# Altium schematic sheet Main.SchDoc
size A3; PageSetup: Record=PageOptions|CenterHorizontal=True|CenterVertical=True|PrintScale=0.73|XCorrection=1.00|YCorrection=1.00|PrintKind=1|BorderSize=5000000|LeftOffset=0|BottomOffset=0|Orientation=2|PaperLength=1000|PaperWidth=1000|Scale=100|PaperSource=7|PrintQuality=-3|MediaType=1|DitherType=10|PrintScaleMode=1|PaperKind=A4|PaperIndex=9
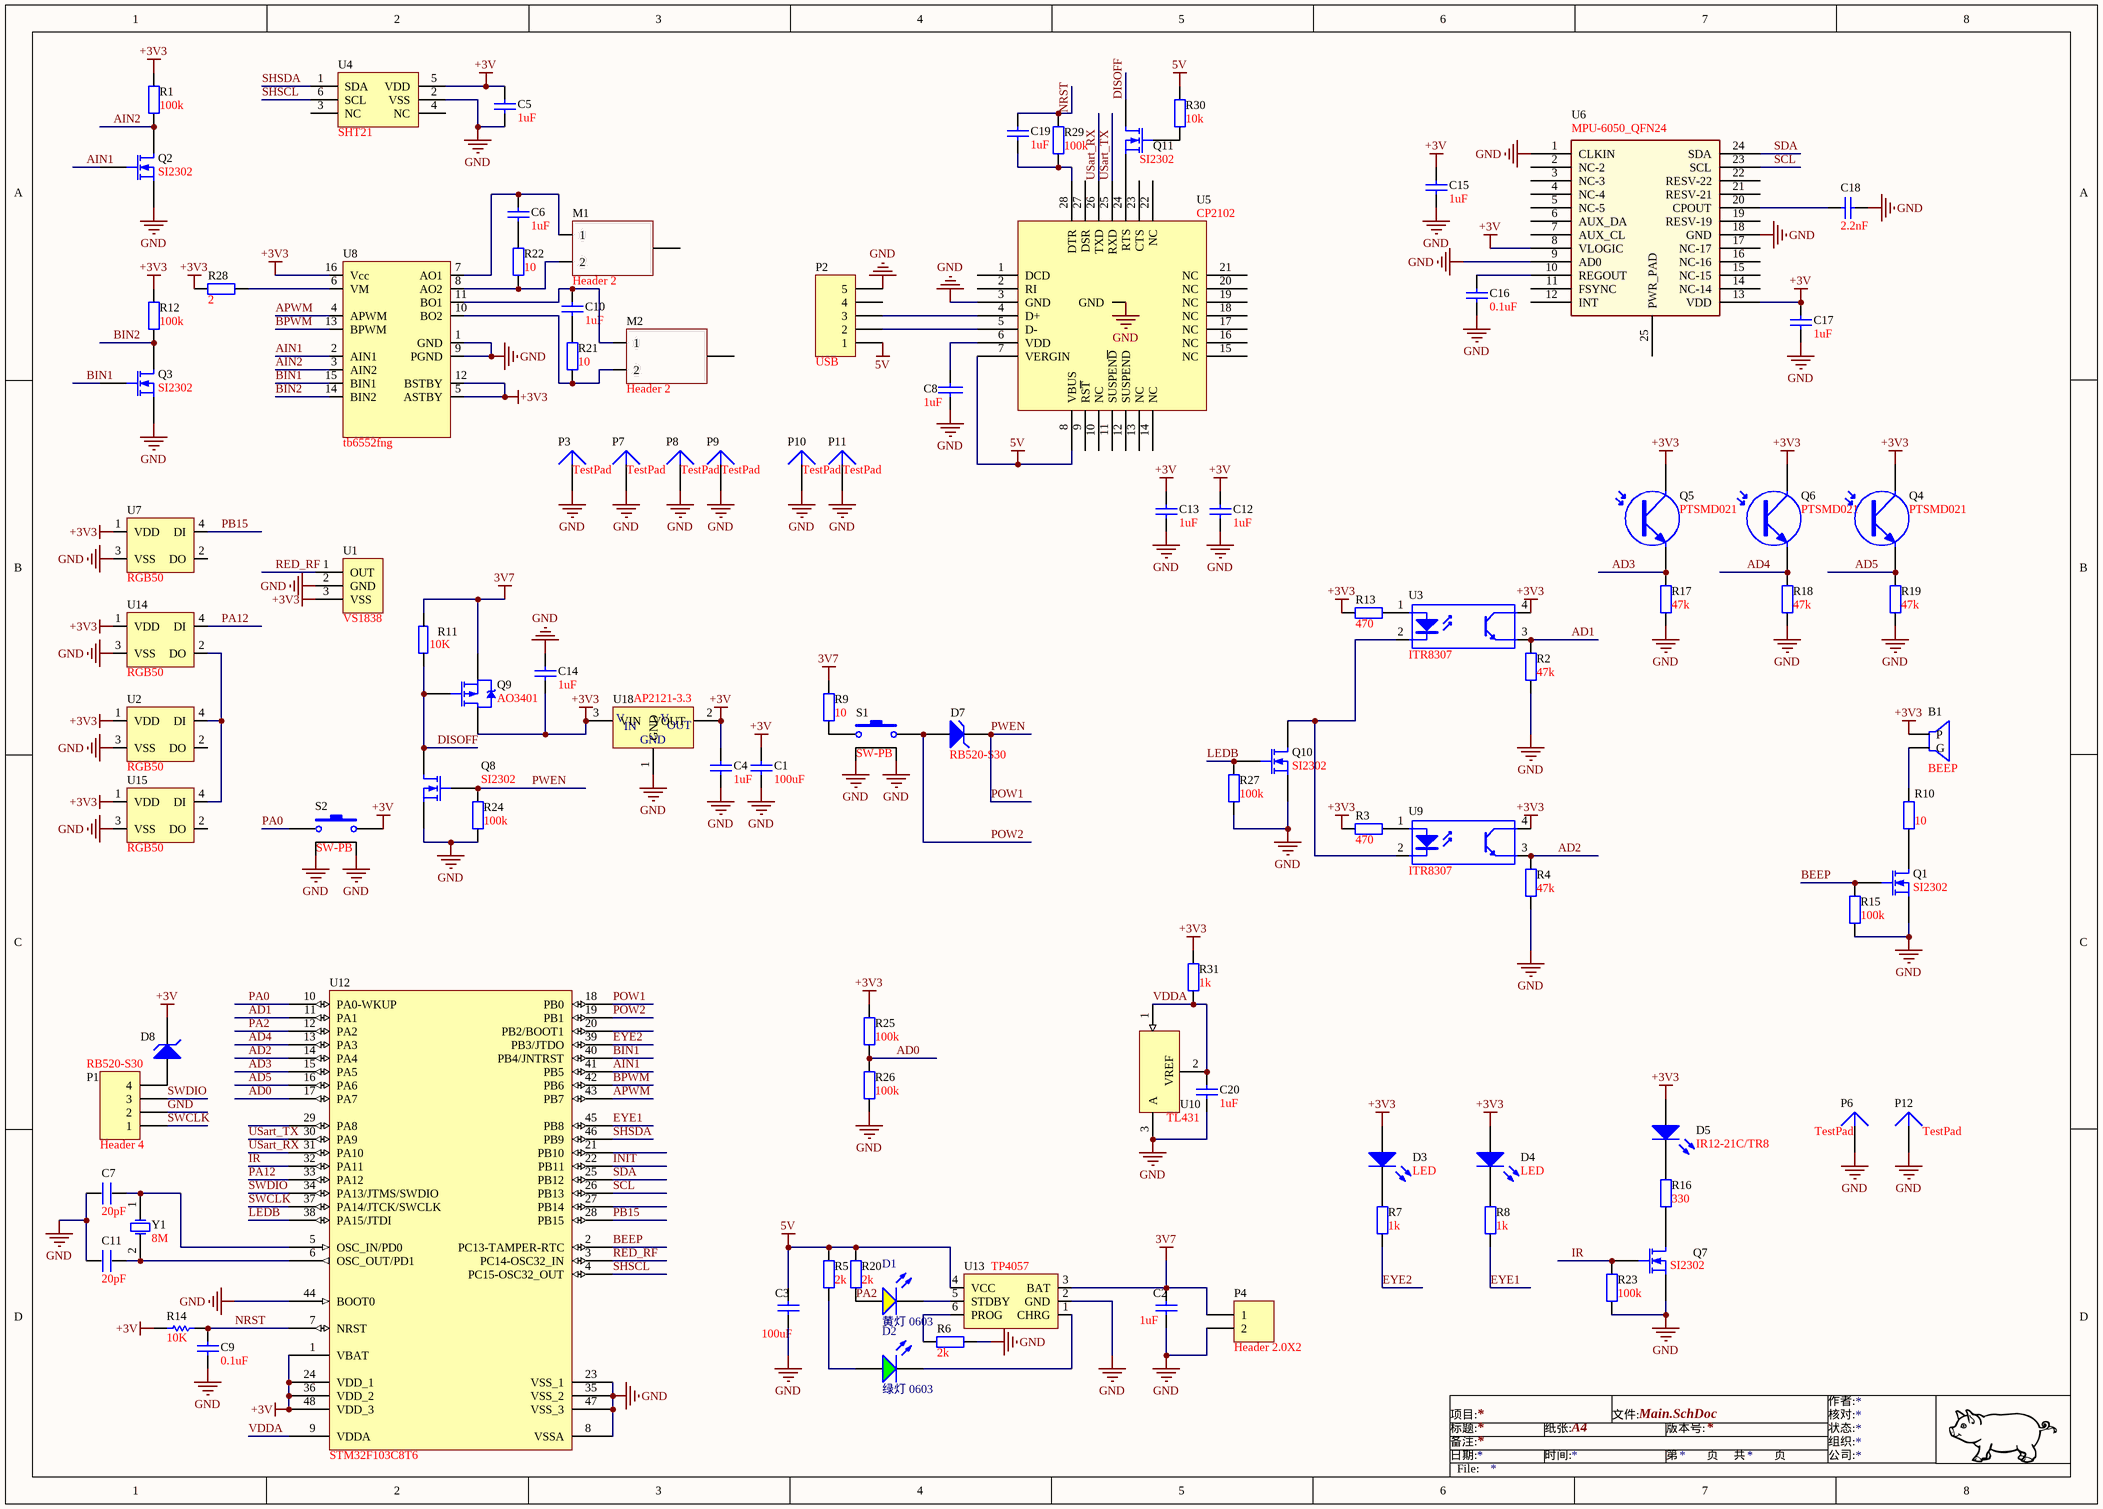
[diagram p0: Main.SchDoc]

## Parts
B1  BEEP  [BEEP]
C1  100uF  [3.5X2.8X1.9]
C2  1uF  [C0603]
C3  100uF  [3.5X2.8X1.9]
C4  1uF  [C0603]
C5  1uF  [c0603]
C6  1uF  [c0603]
C7  20pF  [C0603]
C8  1uF  [C0603]
C9  0.1uF  [C0603]
C10  1uF  [c0603]
C11  20pF  [C0603]
C12  1uF  [C0603]
C13  1uF  [C0603]
C14  1uF  [C0603]
C15  1uF  [C0603]
C16  0.1uF  [C0603]
C17  1uF  [C0603]
C18  2.2nF  [C0603]
C19  1uF  [c0603]
C20  1uF  [C0603]
D1  黄灯 0603  [0603_LED_S1]
D2  绿灯 0603  [0603_LED_S1]
D3  LED  [0802]
D4  LED  [0802]
D5  IR12-21C/TR8  [1206]
D7  RB520-S30  [LED]
D8  RB520-S30  [LED]
M1  Header 2  [PAD2]
M2  Header 2  [PAD2]
P1  Header 4  [SIP1.25-4]
P2  USB  [MICROUSB4]
P3  TestPad  [MOTO]
P4  Header 2.0X2  [Head2.0]
P6  TestPad  [PAD]
P7  TestPad  [MOTO]
P8  TestPad  [PAD]
P9  TestPad  [PAD]
P10  TestPad  [PAD]
P11  TestPad  [PAD]
P12  TestPad  [PAD]
Q1  SI2302  [SOT-23_L]
Q2  SI2302  [SOT-23_L]
Q3  SI2302  [SOT-23_L]
Q4  PTSMD021  [EYE]
Q5  PTSMD021  [EYE]
Q6  PTSMD021  [EYE]
Q7  SI2302  [SOT-23_L]
Q8  SI2302  [SOT-23_L]
Q9  AO3401  [SOT23_L]
Q10  SI2302  [SOT-23_L]
Q11  SI2302  [SOT-23_L]
R1  100k  [R0603]
R2  47k  [R0603]
R3  470  [R0603]
R4  47k  [R0603]
R5  2k  [R0603]
R6  2k  [R0603]
R7  1k  [R0603]
R8  1k  [R0603]
R9  10  [R0603]
R10  10  [R0603]
R11  10K  [R0603]
R12  100k  [R0603]
R13  470  [R0603]
R14  10K  [R0603]
R15  100k  [R0603]
R16  330  [R0603]
R17  47k  [R0603]
R18  47k  [R0603]
R19  47k  [R0603]
R20  2k  [R0603]
R21  10  [R0603]
R22  10  [R0603]
R23  100k  [R0603]
R24  100k  [R0603]
R25  100k  [R0603]
R26  100k  [R0603]
R27  100k  [R0603]
R28  2  [R0603]
R29  100k  [R0603]
R30  10k  [R0603]
R31  1k  [R0603]
S1  SW-PB  [BUTTON]
S2  SW-PB  [BUTTON]
U1  VS1838  [IR38]
U2  RGB50  [HV-EYE - duplicate]
U3  ITR8307  [ITR8307]
U4  SHT21  [SHT20]
U5  CP2102  [qfn-28]
U6  MPU-6050_QFN24  [qfn24]
U7  RGB50  [WS2812]
U8  tb6552fng  [SSOP16_L]
U9  ITR8307  [ITR8307]
U10  TL431  [SOT-23_L]
U12  STM32F103C8T6  [LQFP48_N]
U13  TP4057  [SOT23-6_N]
U14  RGB50  [WS2812]
U15  RGB50  [HV-EYE - duplicate]
U18  AP2121-3.3  [SOT-23]
Y1  8M  [16mhz]

## Nets
3V7: C2.2 P4.1 Q9.3(S) R9.2 R11.2 U13.3(BAT)
5V: C3.2 P2.1 R5.2 R20.2 R30.2 U5.7(VERGIN) U5.8(VBUS) U13.4(VCC)
+3V: C1.2 C4.1 C5.1 C12.1 C13.1 C15.1 C17.1 D8.2(K) R14.2 S2.1 U4.5(VDD) U6.8(VLOGIC) U6.13(VDD) U12.1(VBAT) U12.24(VDD_1) U12.36(VDD_2) U12.48(VDD_3) U18.2(VOUT)
+3V3: B1.1(P) C14.2 D3.1(A) D4.1(A) D5.1(A) Q4.1(C) Q5.1(C) Q6.1(C) Q9.2(D) R1.2 R3.1 R12.2 R13.1 R25.2 R28.2 R31.2 U1.3(VSS) U2.1(VDD) U3.4(C) U7.1(VDD) U8.5(ASTBY) U8.12(BSTBY) U8.16(Vcc) U9.4(C) U14.1(VDD) U15.1(VDD) U18.3(VIN)
GND: C1.1 C2.1 C3.1 C4.2 C5.2 C7.1 C8.1 C9.1 C11.1 C12.2 C13.2 C14.1 C15.2 C16.2 C17.2 C18.2 C20.2 P1.2 P2.5 P3.1 P4.2 P6.1 P7.1 P8.1 P9.1 P10.1 P11.1 P12.1 Q1.3(S) Q2.3(S) Q3.3(S) Q7.3(S) Q8.3(S) Q10.3(S) R2.1 R4.1 R6.1 R15.1 R17.2 R18.2 R19.2 R23.1 R24.1 R26.1 R27.1 S1.3 S1.4 S2.3 S2.4 U1.2(GND) U2.3(VSS) U4.2(VSS) U5.0(GND) U5.3(GND) U6.1(CLKIN) U6.9(AD0) U6.18(GND) U7.3(VSS) U8.1(GND) U8.9(PGND) U10.3(A) U12.8(VSSA) U12.23(VSS_1) U12.35(VSS_2) U12.44(BOOT0) U12.47(VSS_3) U13.2(GND) U14.3(VSS) U15.3(VSS) U18.1(GND)
AD0: R25.1 R26.2 U12.17(PA7)
AD1: R2.2 U3.3(E) U12.11(PA1)
AD2: R4.2 U9.3(E) U12.14(PA4)
AD3: Q5.2(E) R17.1 U12.15(PA5)
AD4: Q6.2(E) R18.1 U12.13(PA3)
AD5: Q4.2(E) R19.1 U12.16(PA6)
AIN1: Q2.2(G) U8.2(AIN1) U12.41(PB5)
AIN2: Q2.1(D) R1.1 U8.3(AIN2)
APWM: U8.4(APWM) U12.43(PB7)
BEEP: Q1.2(G) R15.2 U12.2(PC13-TAMPER-RTC)
BIN1: Q3.2(G) U8.15(BIN1) U12.40(PB4/JNTRST)
BIN2: Q3.1(D) R12.1 U8.14(BIN2)
BPWM: U8.13(BPWM) U12.42(PB6)
DISOFF: Q8.1(D) Q9.1(G) Q11.1(D) R11.1
EYE1: R8.1 U12.45(PB8)
EYE2: R7.1 U12.39(PB3/JTDO)
INIT: U12.22(PB11)
IR: Q7.2(G) R23.2 U12.32(PA11)
LEDB: Q10.2(G) R27.2 U12.38(PA15/JTDI)
NRST: C9.2 C19.1 R14.1 R29.2 U12.7(NRST)
PA0: S2.2 U12.10(PA0-WKUP)
PA2: D1.A R20.1 U12.12(PA2)
PA12: U12.33(PA12) U14.4(DI)
PB15: U7.4(DI) U12.28(PB15)
POW1: D7.2(K) Q8.2(G) R24.2 U12.18(PB0)  [also labelled PWEN]
POW2: D7.1(A) S1.2 U12.19(PB1)
RED_RF: U1.1(OUT) U12.3(PC14-OSC32_IN)
SCL: U6.23(SCL) U12.26(PB13)
SDA: U6.24(SDA) U12.25(PB12)
SHSCL: U4.6(SCL) U12.4(PC15-OSC32_OUT)
SHSDA: U4.1(SDA) U12.46(PB9)
SWCLK: P1.1 U12.37(PA14/JTCK/SWCLK)
SWDIO: P1.3 U12.34(PA13/JTMS/SWDIO)
USart_RX: U5.26(TXD) U12.31(PA10)
USart_TX: U5.25(RXD) U12.30(PA9)
VDDA: C20.1 R31.1 U10.1(K) U10.2 U12.9(VDDA)
NetB1_2: B1.2(G) R10.2
NetC6_1: C6.1 M1.1 U8.7(AO1)
NetC6_2: C6.2 R22.2
NetC7_2: C7.2 U12.5(OSC_IN/PD0) Y1.1(OSC1)
NetC8_2: C8.2 U5.6(VDD)
NetC10_1: C10.1 M2.1 U8.11(BO1)
NetC10_2: C10.2 R21.2
NetC11_2: C11.2 U12.6(OSC_OUT/PD1) Y1.2(OSC2)
NetC16_1: C16.1 U6.10(REGOUT)
NetC18_1: C18.1 U6.20(CPOUT)
NetC19_2: C19.2 R29.1 U5.28(DTR)
NetD1_K: D1.K U13.5(STDBY)
NetD2_A: D2.A R5.1
NetD2_K: D2.K U13.1(CHRG)
NetD3_2: D3.2(K) R7.2
NetD4_2: D4.2(K) R8.2
NetD5_2: D5.2(K) R16.2
NetD8_1: D8.1(A) P1.4
NetM1_2: M1.2 R22.1 U8.8(AO2)
NetM2_2: M2.2 R21.1 U8.10(BO2)
NetP2_2: P2.2 U5.5(D-)
NetP2_3: P2.3 U5.4(D+)
NetQ1_1: Q1.1(D) R10.1
NetQ7_1: Q7.1(D) R16.1
NetQ10_1: Q10.1(D) U3.2(K) U9.2(K)
NetQ11_2: Q11.2(G) R30.1
NetQ11_3: Q11.3(S) U5.24(RTS)
NetR3_2: R3.2 U9.1(A)
NetR6_2: R6.2 U13.6(PROG)
NetR9_1: R9.1 S1.1
NetR13_2: R13.2 U3.1(A)
NetR28_1: R28.1 U8.6(VM)
NetU2_4: U2.4(DI) U14.2(DO) U15.4(DI)

Not connected (* = marked no-connect by the designer): P2 4; U2 2(DO); U4 3(NC) 4(NC); U5 1(DCD) 2(RI) 9(RS~{T}) 10(NC) 11(SUSPEN~{D}) 12(SUSPEND) 13(NC) 14(NC) 15(NC) 16(NC) 17(NC) 18(NC) 19(NC) 20(NC) 21(NC) 22(NC) 23(CTS) 27(DSR); U6 2(NC-2) 3(NC-3) 4(NC-4) 5(NC-5) 6(AUX_DA) 7(AUX_CL) 11(FSYNC) 12(INT) 14(NC-14) 15(NC-15) 16(NC-16) 17(NC-17) 19(RESV-19) 21(RESV-21) 22(RESV-22) 25(PWR_PAD); U7 2(DO); U12 20(PB2/BOOT1) 21(PB10) 27(PB14) 29(PA8); U15 2(DO)

## Notes on the sheet
- 项目:
- 标题:
- 日期:
- 备注:
- 时间:
- 纸张:
- A4
- 文件:
- 版本号:
- 第
- 页
- 共
- 作者:
- 核对:
- 状态:
- 组织:
- 公司:
- File:
- (in symbol AP2121-3) V; IN; OUT
- (in symbol TL431AILP) VREF

## Library data of the parts
B1 = BEEP: 最小蜂鸣器6MM 6038 6035电磁式蜂鸣器 6*3.5 6*3.8MM 无源 交流
C1 C3 C16 C18 = Cap: 贴片电容; Value: 1uF; Published: 8-Jun-2000; LatestRevisionDate: 17-Jul-2002; LatestRevisionNote: Re-released for DXP Platform.; PackageReference: RAD-0.3; Publisher: Altium Limited; PackageDescription: Radial Cap, Thru-Hole; 2 Leads; 0.3 in Pin Spacing
C2 = Cap: 贴片电容; Value: 105; Published: 8-Jun-2000; LatestRevisionDate: 17-Jul-2002; LatestRevisionNote: Re-released for DXP Platform.; PackageReference: RAD-0.3; Publisher: Altium Limited; PackageDescription: Radial Cap, Thru-Hole; 2 Leads; 0.3 in Pin Spacing
C4-C6 C10 C12-C15 C17 C19 C20 = Cap: 贴片电容; Published: 8-Jun-2000; LatestRevisionDate: 17-Jul-2002; LatestRevisionNote: Re-released for DXP Platform.; PackageReference: RAD-0.3; Publisher: Altium Limited; PackageDescription: Radial Cap, Thru-Hole; 2 Leads; 0.3 in Pin Spacing; Value: 1uF
C7 C11 = C: 叠层贴片电容
C8 = CAP: 贴片电容
C9 = CAP: 电容; Value: 100pF; Published: 8-Jun-2000; Revision: July-2002: Re-released for DXP Platform.; Publisher: Altium Limited
D1 = 0603 黄灯: 发光二极管; ComponentLink1Description: 供应商链接; ComponentLink1URL: http://www.szlcsc.com/product/details_73147.html; Package: 0603; Supplier: LC; SuppliersPartNumber: C72038
D2 = 0603 绿灯: 发光二极管; ComponentLink1Description: 供应商链接; ComponentLink1URL: http://www.szlcsc.com/product/details_73152.html; Package: 0603; Supplier: LC; SuppliersPartNumber: C72043
D3 D4 = LED2: Typical RED, GREEN, YELLOW, AMBER GaAs LED; pin to pad: 1>2 2>1; Published: 8-Jun-2000; LatestRevisionDate: 17-Jul-2002; LatestRevisionNote: Re-released for DXP Platform.; PackageVersion: Feb-2002; PackageReference: 3.2X1.6X1.1; Publisher: Altium Limited; PackageDescription: SM LED; 2 Flat Leads
D5 = LED2: 侧贴红外发射管; Published: 8-Jun-2000; LatestRevisionDate: 17-Jul-2002; LatestRevisionNote: Re-released for DXP Platform.; PackageVersion: Feb-2002; PackageReference: 3.2X1.6X1.1; Publisher: Altium Limited; PackageDescription: SM LED; 2 Flat Leads
D7 D8 = D Zener: 肖基特二极管; Published: 8-Jun-2000; LatestRevisionDate: 17-Jul-2002; LatestRevisionNote: Re-released for DXP Platform.; PackageReference: DIODE-0.7; Publisher: Altium Limited; PackageDescription: Diode, Thru-Hole; 2 Leads; 0.7 in Pin Spacing
M1 M2 = Header 2: Header, 2-Pin; LatestRevisionDate: 17-Jul-2002; LatestRevisionNote: Re-released for DXP Platform.; Publisher: Altium Limited
P1 = Header 4: Header, 4-Pin; LatestRevisionDate: 17-Jul-2002; LatestRevisionNote: Re-released for DXP Platform.; Publisher: Altium Limited
P2 = Header 5: 迈克USB 接口 4个固定脚插板固定母座-5p贴片长针 MICRO usb接口 [交易快照]; LatestRevisionDate: 17-Jul-2002; LatestRevisionNote: Re-released for DXP Platform.; Publisher: Altium Limited
P3 P6-P12 = Plug: LatestRevisionDate: 17-Jul-2002; LatestRevisionNote: Re-released for DXP Platform.; Publisher: Altium Limited
P4 = Header 2: 2.0dip连接器; LatestRevisionDate: 17-Jul-2002; LatestRevisionNote: Re-released for DXP Platform.; Publisher: Altium Limited
Q1-Q3 Q7 Q8 Q10 Q11 = MOSFET-N: N-Channel MOSFET; pin to pad: 1>3 2>1 3>2; Published: 8-Jun-2000; LatestRevisionDate: 17-Jul-2002; LatestRevisionNote: Re-released for DXP Platform.; PackageVersion: 1995/1996; PackageReference: E3; Publisher: Altium Limited; PackageDescription: TO, Flat Index; 3 In-Line, Axial Leads; Body Dia. 4.6mm; Lead Dia. 0.5 mm (max)
Q4-Q6 = Photo NPN: 光线传感器; Published: 24-Mar-1999; LatestRevisionDate: 17-Jul-2002; LatestRevisionNote: Re-released for DXP Platform.; PackageReference: TO-220_A; Publisher: Altium Limited; Code_JEDEC: TO-220-AC
Q9 = PMOS-2: P沟道电源开关MOS管; pin to pad: 1>3 2>1 3>2; Note: 需要购买; Published: 8-Jun-2000; LatestRevisionDate: 17-Jul-2002; LatestRevisionNote: Re-released for DXP Platform.; DatasheetVersion: PD-9.390D; PackageReference: TO-220AB; Publisher: Altium Limited; Code_JEDEC: TO-220-AB; ComponentLink1Description: Manufacturer Link; ComponentLink1URL: http://www.irf.com/
R1-R5 R9 R10 R12 R13 R15-R20 R23 R24 R27 R28 = Res2: 贴片电阻; Value: 1K; Published: 8-Jun-2000; LatestRevisionDate: 17-Jul-2002; LatestRevisionNote: Re-released for DXP Platform.; PackageReference: AXIAL-0.4; Publisher: Altium Limited; PackageDescription: Axial Device, Thru-Hole; 2 Leads; 0.4 in Pin Spacing
R6 = Res2: 贴片电阻; Value: 1.66K; Published: 8-Jun-2000; LatestRevisionDate: 17-Jul-2002; LatestRevisionNote: Re-released for DXP Platform.; PackageReference: AXIAL-0.4; Publisher: Altium Limited; PackageDescription: Axial Device, Thru-Hole; 2 Leads; 0.4 in Pin Spacing
R7 R8 R21 R22 R25 R26 R29-R31 = Res2: 贴片电阻; Published: 8-Jun-2000; LatestRevisionDate: 17-Jul-2002; LatestRevisionNote: Re-released for DXP Platform.; PackageReference: AXIAL-0.4; Publisher: Altium Limited
  R7 R8: PackageDescription: Axial Device, Thru-Hole; 2 Leads; 0.4 in Pin Spacing; Value: 1K
R11 = R: 贴片电阻
R14 = res1: 电阻; Value: 1K; Published: 8-Jun-2000; Revision: July-2002: Re-released for DXP Platform.; Publisher: Altium Limited
S1 S2 = SW-PB: 3x6x3.5H 3*6*3.5贴片 侧位 按钮; Published: 24-Mar-1999; LatestRevisionDate: 17-Jul-2002; LatestRevisionNote: Re-released for DXP Platform.; PackageReference: SPST-2; Publisher: Altium Limited; PackageDescription: Switch; 2 Leads
U1 = RF: 1838 接收头 VS1838 VS1838B
U2 U15 = RGB50: 全彩REG灯珠PCB附件
U3 U9 = Optoisolator1: 反射式光学传感器; pin to pad: 1>2 2>1 3>4 4>3; Published: 24-Mar-1999; LatestRevisionDate: 04-Mar-2005; LatestRevisionNote: Sch pins 3 & 4 Swapped.; DatasheetVersion: Nov-2003; PackageReference: DIP-4; Publisher: Altium Limited
U4 = SHT21: 温湿度探头(缺省)
U5 = CP2102: usb  转ttl
U6 = MPU06050_QFN24: 三轴陀螺仪加速度
U7 U14 = RGB50: WS2812全彩RGB灯珠
U8 = tb6552fng: 电机驱动芯片
U10 = TL431AILP: TL431BID; Manufacturer: Texas Instruments; Class: Power Management; SubClass: Voltage Regulator; Published: 15/04/2002; Publisher: Altium Hobart Technology Centre
U12 = STM32F103C8T6: 处理器; Published: *; DatasheetVersion: *; PackageVersion: *; PackageReference: *; Publisher: *; PackageDescription: *; ComponentLink1Description: *; ComponentLink1URL: *; ComponentLink2Description: *; ComponentLink2URL: *
U13 = TP4057: 6pin  充电芯片  sot23-6
U18 = AP2121-3: 3V LDO
Y1 = XTAL: cstce8m00g52